# Altium schematic sheet USB.SchDoc
size B
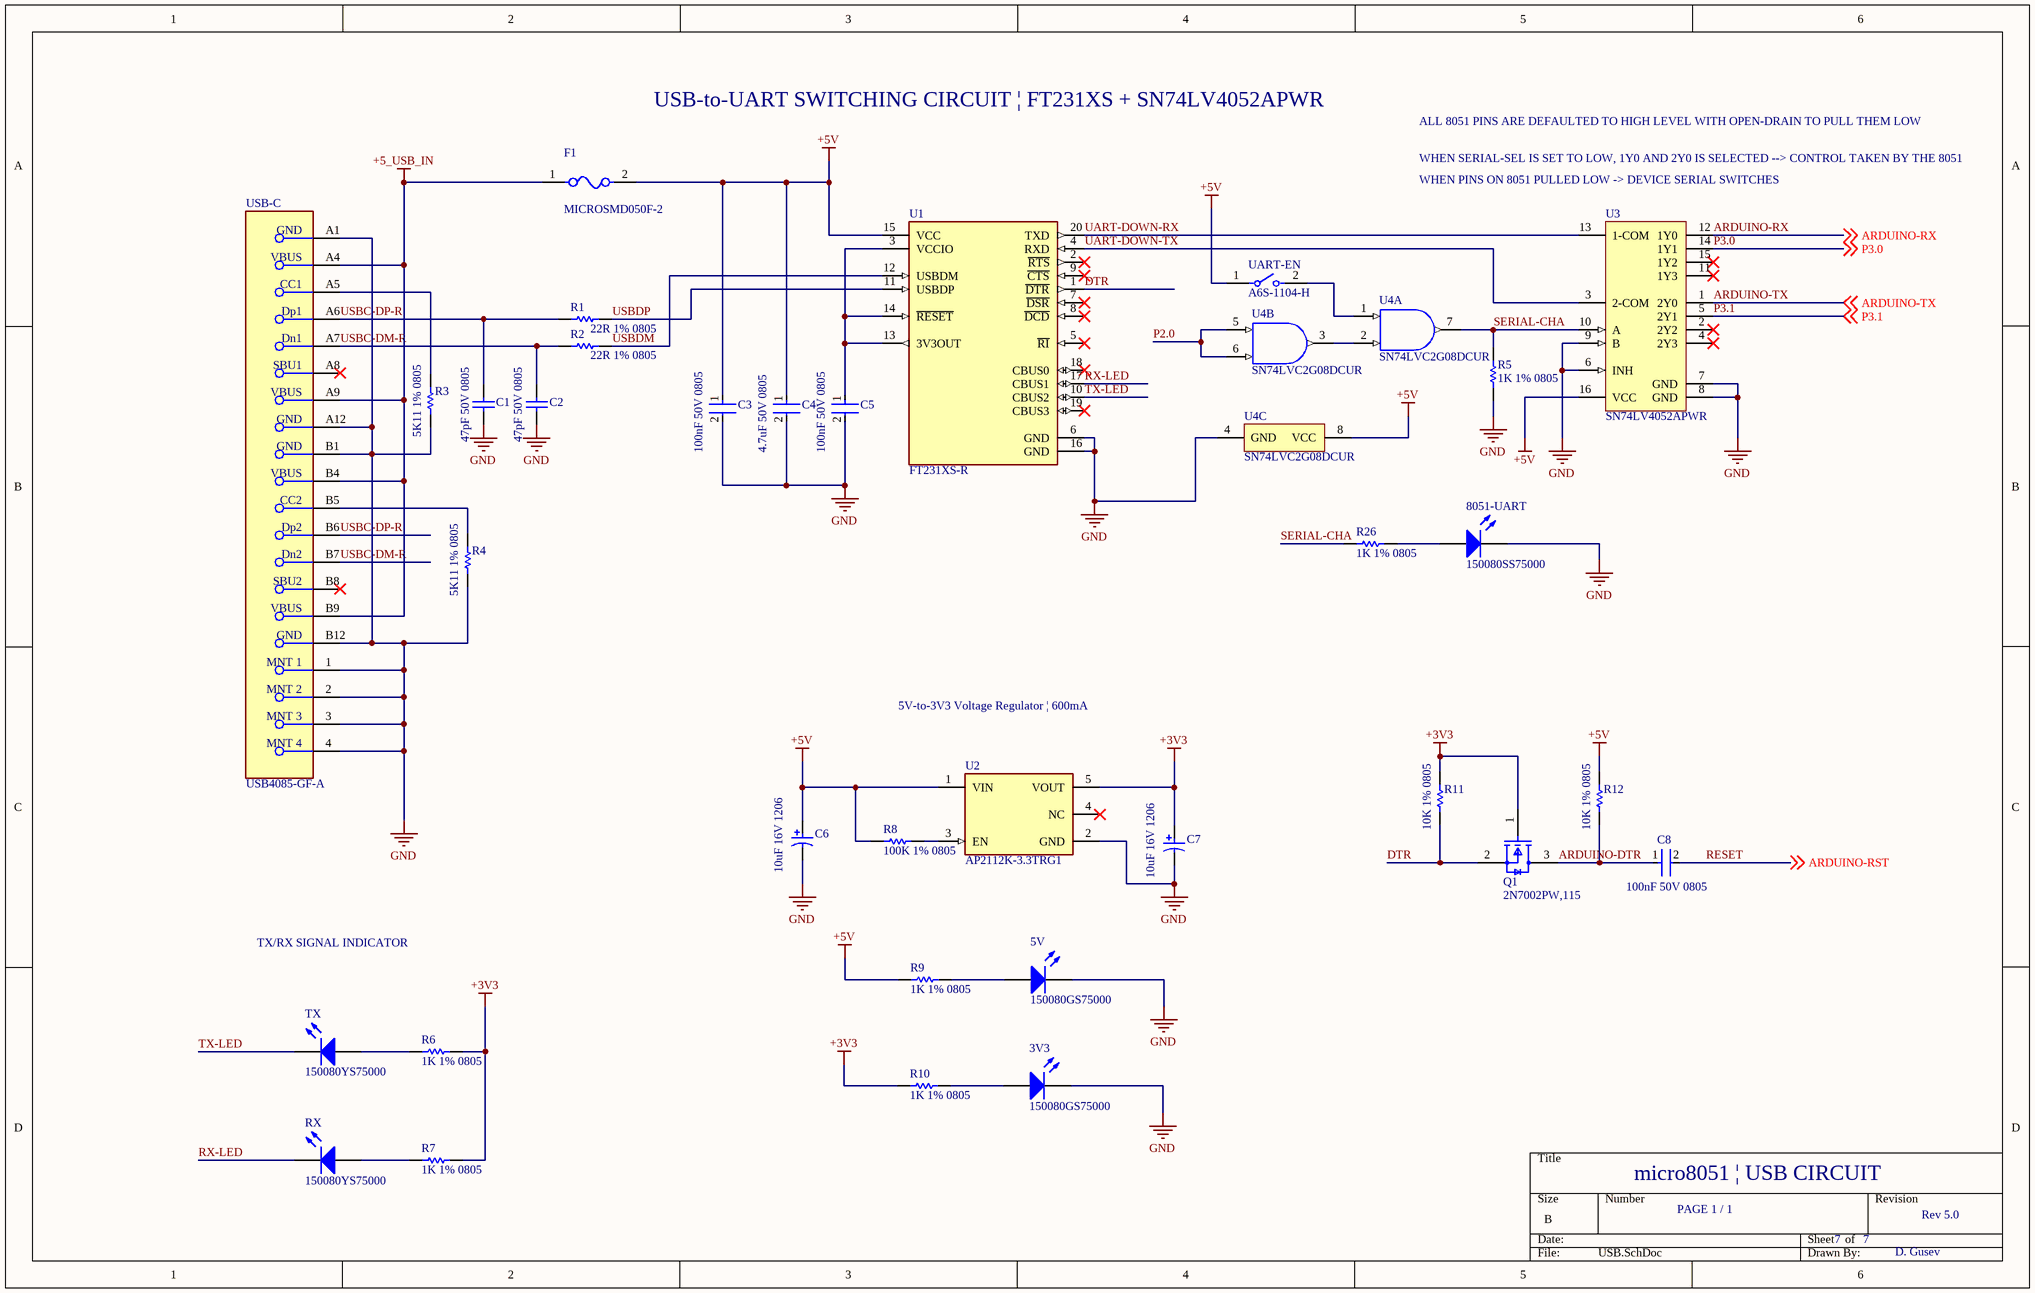
[diagram p0: USB.SchDoc]

## Parts
3V3  150080GS75000  [0805_A]
5V  150080GS75000  [0805_A]
8051-UART  150080SS75000  [0805_A]
C1  47pF 50V 0805  [CAPC2013X71X50NL20T25]
C2  47pF 50V 0805  [CAPC2013X71X50NL20T25]
C3  100nF 50V 0805  [FP-C0805C-DN-MFG]
C4  4.7uF 50V 0805  [FP-C2012-125-MFG]
C5  100nF 50V 0805  [FP-C0805C-DN-MFG]
C6  10uF 16V 1206  [KEMT-A-3216-18-2_M]
C7  10uF 16V 1206  [KEMT-A-3216-18-2_M]
C8  100nF 50V 0805  [FP-C0805C-DN-MFG]
F1  MICROSMD050F-2  [FP-microSMD-MFG]
Q1  2N7002PW,115  [FP-SOT323-MFG]
R1  22R 1% 0805  [RESC2013X70X40LL20T20]
R2  22R 1% 0805  [RESC2013X70X40LL20T20]
R3  5K11 1% 0805  [RESC0805(2012)_N]
R4  5K11 1% 0805  [RESC0805(2012)_N]
R5  1K 1% 0805  [RESC2013X60X40ML20T25]
R6  1K 1% 0805  [RESC2013X60X40ML20T25]
R7  1K 1% 0805  [RESC2013X60X40ML20T25]
R8  100K 1% 0805  [RESC2013X60X35ML10T20]
R9  1K 1% 0805  [RESC2013X60X40ML20T25]
R10  1K 1% 0805  [RESC2013X60X40ML20T25]
R11  10K 1% 0805  [RESC2013X60X35NL10T20]
R12  10K 1% 0805  [RESC2013X60X35NL10T20]
R26  1K 1% 0805  [RESC2013X60X40ML20T25]
RX  150080YS75000  [0805_A]
TX  150080YS75000  [0805_A]
U1  FT231XS-R  [FP-SSOP-20-MFG]
U2  AP2112K-3.3TRG1  [FP-SOT25-IPC_A]
U3  SN74LV4052APWR  [PW0016A_M]
U4  SN74LVC2G08DCUR  [DCU0008A_M]  (parts A,B,C of 3)
UART-EN  A6S-1104-H  [FP-A6S-1104-H-MFG]
USB-C  USB4085-GF-A  [FP-USB4085-GF-A-MFG]

## Nets
+3V3: C7.1 Q1.1(G) R6.1 R7.1 R10.2 R11.2 U2.5(VOUT)
+5_USB_IN: F1.1 USB-C.A4(VBUS) USB-C.A9(VBUS) USB-C.B4(VBUS) USB-C.B9(VBUS)
+5V: C3.1 C4.1 C6.1 F1.2 R8.2 R9.2 R12.2 U1.15(VCC) U2.1(VIN) U3.16(VCC) U4.8(VCC) UART-EN.1
GND: 3V3.1(K) 5V.1(K) 8051-UART.1(K) C1.1 C2.1 C3.2 C4.2 C5.2 C6.2 C7.2 R3.1 R4.1 R5.2 U1.6(GND) U1.16(GND) U2.2(GND) U3.6(INH) U3.7(GND) U3.8(GND) U3.9(B) U4.4(GND) USB-C.1(MNT_1) USB-C.2(MNT_2) USB-C.3(MNT_3) USB-C.4(MNT_4) USB-C.A1(GND) USB-C.A12(GND) USB-C.B1(GND) USB-C.B12(GND)
ARDUINO-DTR: C8.1 Q1.3(D) R12.1
ARDUINO-RX: U3.12(1Y0) ; off-sheet ARDUINO-RX
ARDUINO-TX: U3.1(2Y0) ; off-sheet ARDUINO-TX
DTR: Q1.2(S) R11.1 U1.1(~{DTR})
P2.0: U4.5(2A) U4.6(2B)
P3.0: U3.14(1Y1) ; off-sheet P3.0
P3.1: U3.5(2Y1) ; off-sheet P3.1
RESET: C8.2 ; off-sheet ARDUINO-RST  [also labelled ARDUINO-RST]
RX-LED: RX.1(K) U1.17(CBUS1)
SERIAL-CHA: R5.1 R26.1 U3.10(A) U4.7(1Y)
TX-LED: TX.1(K) U1.10(CBUS2)
UART-DOWN-RX: U1.20(TXD) U3.13(1-COM)
UART-DOWN-TX: U1.4(RXD) U3.3(2-COM)
USBC-DM-R: C2.2 R2.1 USB-C.A7(Dn1) USB-C.B7(Dn2)
USBC-DP-R: C1.2 R1.1 USB-C.A6(Dp1) USB-C.B6(Dp2)
USBDM: R2.2 U1.12(USBDM)
USBDP: R1.2 U1.11(USBDP)
Net3V3_2: 3V3.2(A) R10.1
Net5V_2: 5V.2(A) R9.1
Net8051-UART_2: 8051-UART.2(A) R26.2
NetC5_1: C5.1 U1.3(VCCIO) U1.13(3V3OUT) U1.14(~{RESET})
NetR3_2: R3.2 USB-C.A5(CC1)
NetR4_2: R4.2 USB-C.B5(CC2)
NetR6_2: R6.2 TX.2(A)
NetR7_2: R7.2 RX.2(A)
NetR8_1: R8.1 U2.3(EN)
NetU4_1: U4.1(1A) UART-EN.2
NetU4_2: U4.2(1B) U4.3(2Y)

Not connected (* = marked no-connect by the designer): U1 2(~{RTS})* 5(~{RI})* 7(~{DSR})* 8(~{DCD})* 9(~{CTS})* 18(CBUS0)* 19(CBUS3)*; U2 4(NC)*; U3 2(2Y2)* 4(2Y3)* 11(1Y3)* 15(1Y2)*; USB-C A8(SBU1)* B8(SBU2)*

## Notes on the sheet
- USB-to-UART SWITCHING CIRCUIT | FT231XS + SN74LV4052APWR
- WHEN SERIAL-SEL IS SET TO LOW, 1Y0 AND 2Y0 IS SELECTED --> CONTROL TAKEN BY THE 8051
- ALL 8051 PINS ARE DEFAULTED TO HIGH LEVEL WITH OPEN-DRAIN TO PULL THEM LOW
- (near U3) WHEN PINS ON 8051 PULLED LOW -> DEVICE SERIAL SWITCHES
- 5V-to-3V3 Voltage Regulator | 600mA
- TX/RX SIGNAL INDICATOR
- micro8051 | USB CIRCUIT
- PAGE 1 / 1
- 7
- Rev 5.0
- D. Gusev

## Library data of the parts
3V3 5V = CMP-1426-00007-1: SMD mono-color Chip LED, WL-SMCW, Green; Manufacturer: Wuerth Elektronik; PackageReference: 0805_A; Color: Green; PartNumber: 150080GS75000; ComponentLink2URL: http://katalog.we-online.com/led/datasheet/150080GS75000.pdf; ComponentLink1URL: http://www.we-online.com; ComponentLink1Description: Manufacturer URL; ComponentLink2Description: Datasheet
8051-UART = CMP-1426-00010-1: SMD mono-color Chip LED, WL-SMCW, Super Red; Manufacturer: Wuerth Elektronik; PackageReference: 0805_A; ComponentLink2URL: http://katalog.we-online.com/led/datasheet/150080SS75000.pdf; ComponentLink1URL: http://www.we-online.com; Color: Super Red; ComponentLink2Description: Datasheet; ComponentLink1Description: Manufacturer URL; PartNumber: 150080SS75000
C1 C2 = CMP-2007-04508-1: Part Number: 08055A470JAT2A; Manufacturer: AVX Interconnect / Elco
C3 C5 C8 = CMP-2007-00279-2: CAP CER 0.1UF 50V X7R 0805; Manufacturer Part Number: C0805C104K5RACTU; Manufacturer: KEMET; Value: 0.10 μF; Tolerance: 0.1; Temperature Coefficient: 30ppm/°C; Material: Ceramic; Device Class L2: Capacitors; Temperature Range Low: -55°C; Voltage Rating: 50 V; Digikey Description: CAP CER 0.1UF 50V X7R 0805; Category: Cap; ComponentLink2Description: Datasheet; Octopart: https://octopart.com/c0805c104k5ractu-kemet-143926; RoHS: TRUE; ComponentLink2URL: https://content.kemet.com/datasheets/KEM_C1003_C0G_SMD.pdf; Temperature Characteristic: X7R; Temperature: -55°C to +125°C; Height: 0.88mm; Temperature Range High: +125°C; Device Class L1: Passive Components; Automotive: No; Lead Free: Yes; Ipc Land Pattern Name: CAPC200125X78; Device Class L3: Ceramic Capacitors; Mouser Description: Cap Ceramic 0.1uF 50V X7R 10% SMD 2.0 x 1.2 mm 125 C Paper T/R; Capacitance: 0.10 μF; Package: C0805C-DN
C4 = CMP-08246-000007-1: CAP CER 4.7UF 50V X5R 0805; Manufacturer Part Number: C2012X5R1H475K125AB; Manufacturer: TDK Corporation; Tolerance: 10%; Temperature Coefficient: 15%; Material: Ceramic; Mouser Description: Multilayer Ceramic Capacitors MLCC - SMD/SMT 0805 4.7uF 50volts X5R 10%; Category: Cap; Temperature Range High: +85°C; Digikey Description: CAP CER 4.7UF 50V X5R 0805; Voltage Rating: 50V; Device Class L1: Passive Components; Temperature Range Low: -55°C; Lead Free: Yes; ComponentLink2Description: Datasheet; Capacitance: 4.7uF; Octopart: https://octopart.com/c2012x5r1h475k125ab-tdk-25947720; Device Class L2: Capacitors; Value: 4.7uF; Temperature: -55°C to +85°C; ComponentLink2URL: https://product.tdk.com/info/en/catalog/datasheets/mlcc_commercial_general_en.pdf; RoHS: TRUE; Height: 1.45mm; Temperature Characteristic: X5R; Package: C2012-125; Device Class L3: Ceramic Capacitors; Automotive: No
C6 C7 = CMP-2000-05173-1: Capacitor, Tantalum, 10 uF, +/- 10%, 16 V, -55 to 125 degC, 2-Pin SMD (1206), RoHS, Tape and Reel; Manufacturer: Kemet; Insulation: NotRequired; Voltage: 16VDC; Product Height (mm): 1.6mm; Polarity: Polar; Lead Spacing (nom): NotRequiredmm; Product Length (mm): 3.2mm; Case Style: Molded; DCL: 1.6uA; ESR: 7ohm; DF: 8%; Mounting Style: SurfaceMount; Manufacturer URL: http://www.kemet.com/; Datasheet Version: Apr-14; Package Description: 2-Pin Surface Mount Device, Body 3.2 x 1.6 mm; Operating Temp Range: -55Cto125C; Package Reference: 1206; Capacitance: 10uF; Wire Form: NotRequired; Datasheet URL: http://www.farnell.com/datasheets/1824869.pdf; Tolerance (+ or -): 10%; Failure Rate: NotRequired; Length W/Weld: NotRequiredmm; Package / Case: 3216-18; Seated Plane Height: NotRequiredmm; Product Diameter (mm): NotRequiredmm; Construction: SMTChip; Seal: NotRequired; Case Code: A; Product Depth (mm): 1.6mm; Packaging: TapeandReel
F1 = CMP-08606-000015-1: PTC RESET FUSE 13.2V 500MA 1210; Manufacturer: Littelfuse; Hold Current: 0.5A; Resistance: 0.25-0.9Ω; Trip Time: 0.05s; Value: 0.25-0.9Ω; Trip Current: 1A; Current Rating: 40A; Device Class L3: unset; ComponentLink2URL: https://www.littelfuse.com/~/media/electronics/datasheets/resettable_ptcs/littelfuse_ptc_microsmd_datasheet.pdf.pdf; Temperature: to +85°C; ComponentLink2Description: Datasheet; RoHS: TRUE; Category: Fuse; Ambient Temperature Range Low: -40°C; Lead Free: Yes; Device Class L1: Circuit Protection; Manufacturer Part Number: MICROSMD050F-2; Temperature Range High: +85°C; Ambient Temperature Range High: +85°C; Automotive: No; Height: 0.62mm; Digikey Description: PTC RESET FUSE 13.2V 500MA 1210; Voltage Rating: 13.2V; Package: microSMD; Octopart: https://octopart.com/microsmd050f-2-littelfuse-74214982; Device Class L2: PTC Resettable Fuses
Q1 = CMP-14409-000019-1: MOSFET N-CH 60V 0.31A SOT323
R1 R2 = CMP-2001-00523-1: Part Number: ERJ6ENF22R0V; Manufacturer: Panasonic
R3 R4 = CMP-1013-00591-1: 5K11 0.125W 1% 0805 (2012 Metric)  SMD; Case-Metric: 2012; Value: 5110.00 Ohm; Case-EIA: 0805; Technology: SMT; Tolerance: 1 %; Power: 0.125 W
R5-R7 R9 R10 R26 = CMP-2001-00590-1: Part Number: ERA6AEB123V; Manufacturer: Panasonic
R8 = CMP-2100-03668-1: Chip Resistor, 100 KOhm, +/- 1%, 0.125 W, -55 to 155 degC, 0805 (2012 Metric), RoHS, Tape and Reel; Manufacturer: Yageo; Max Power Dissipation: 125mW; Voltage Rating: 150V; Temperature Coefficient: 100ppm/degreesC; Manufacturer URL: http://www.yageo.com/; Min Operating Temperature: -55degC; Lead Pitch: 0.4mm; Composition: ThickFilm; Case Code (Metric): 2012; Military Standard: Not; Package Description: 2-Pin Surface Mounted Device, Body 2 x 1.25 mm; REACH SVHC: Unknown; RoHSCompliant: true; Depth: 1.25mm; Number of Pins: 2; Lead Free: LeadFree; Resistance: 100KOhm; Datasheet URL: http://www.yageo.com/NewPortal/yageodocoutput?fileName=/pdf/R-Chip/PYu-RC_Group_51_RoHS_L_5.pdf; Max Operating Temperature: 155degC; Case/Package: 0805; Package Quantity: 1; Case Code (Imperial): 0805; Power Rating: 125mW; Width: 0.049inch; Package Reference: 0805; Height: 0.024inch; Termination: SMD/SMT; Tolerance: 1%; Datasheet Version: Rev. 5, 10/2016; Length: 2mm; Voltage Rating (DC): 150V; Number of Terminations: 2; Packaging: TapeandReel
R11 R12 = CMP-1659-00013-4: Chip Resistor, 10 KOhm, +/- 1%, 0.125 W, -55 to 155 degC, 0805 (2012 Metric), RoHS, Tape and Reel; Manufacturer: Yageo; Voltage Rating: 150 V; Mount: Surface Mount; ComponentLink1Description: Manufacturer URL; ComponentLink2URL: http://www.yageo.com/documents/recent/PYu-RC_Group_51_RoHS_L_04.pdf; Pins: 2; Length: 2 mm; Min Operating Temperature: -55 degC; Height: 0.5 mm; Mounting Technology: Surface Mount; RoHSCompliant: true; REACH SVHC: No SVHC; ComponentLink1URL: http://www.yageo.com/; Max Operating Temperature: 155 degC; PackageReference: 0805; DatasheetVersion: Rev. 4, 02/2016; Package Quantity: 5000; Packaging: Tape and Reel; ComponentLink2Description: Datasheet; PackageDescription: 2-Pin Surface Mounted Device, Body 2 x 1.25 mm
RX TX = CMP-1426-00012-1: SMD mono-color Chip LED, WL-SMCW, Yellow; Manufacturer: Wuerth Elektronik; Color: Yellow; ComponentLink1URL: http://www.we-online.com; PackageReference: 0805_A; ComponentLink2URL: http://katalog.we-online.com/led/datasheet/150080YS75000.pdf; ComponentLink1Description: Manufacturer URL; ComponentLink2Description: Datasheet; PartNumber: 150080YS75000
U1 = CMP-0248-00024-3: IC USB SERIAL FULL UART 20SSOP; Operating Supply Voltage: 5V; Operating Supply Current: 8mA; Number of Channels: 1; Min Supply Voltage: 2.97V; Max Supply Voltage: 5.5V; Data Rate: 12Mbps; Height: 0.059inch; Packaging: Tape and Reel; Mount: Surface Mount; Package Quantity: 2000; Radiation Hardening: No; Case/Package: SSOP; Min Operating Temperature: -40°C; Width: 0.157inch; Number of Pins: 20; Weight: 0.016oz; Interface: UART; Max Operating Temperature: 85°C; Length: 8.74mm
U2 = CMP-12756-000035-1: IC REG LINEAR 3.3V 600MA SOT25; Number of Regulators: 1; Output Type: Fixed; Polarity: Positive; Min Input Voltage: 2.5V; Max Input Voltage: 6V; Accuracy: 1.5%; Quiescent Current: 55uA; Dropout Voltage: 250mV; Min Operating Temperature: -40°C; Length: 3.1mm; Output Current: 600mA; Max Operating Temperature: 85°C; Package Quantity: 1; Output Voltage: 3.3V; Width: 1.7mm; Number of Outputs: 1; Packaging: Tape and Reel; Height: 1.3mm; Lead Free: Lead Free; Max Output Current: 600mA; Case/Package: SOT-23-5; Mount: Surface Mount; Number of Pins: 5
U3 = CMP-0802-00041-4: Dual 4-Channel Analog Multiplexer/Demultiplexer, PW0016A, LARGE T&R; Manufacturer: Texas Instruments; VCC(Min)(V): 2; Crosstalk: Yes; Rating: Catalog; Ron(Max)(Ohms): 75; Ron(Typ)(Ohms): 25; Configuration: 2 X 1：4 MUX; VCC(Max)(V): 5.5; Bandwidth(Max)(MHz): 50; Output Type: CMOS; PackageReference: PW0016A; Operating Temperature Range(C): -40 to 85; DatasheetVersion: SCLS429J; PackageVersion: http://www.ti.com/lit/ml/mpds361/mpds361.pdf; Generic Part Number: SN74LV4052A; Code_JEDEC: MO-153
U4 = CMP-0859-00670-3: Dual 2-Input Positive-AND Gate, DCU0008A, LARGE T&R; Manufacturer: Texas Instruments; Logic: True; Output Drive (IOL/IOH)(Max)(mA): 32/-32; F @ Nom Voltage(Max)(Mhz): 150; Technology Family: LVC; Rating: Catalog; tpd @ Nom Voltage(Max)(ns): 9.8,5.8,5.3,4.8; Voltage(Nom)(V): 1.8,2.5,3.3,5; Schmitt Trigger: No; Input Type: CMOS/TTL; Bits(#): 2; Gate Type: AND; VCC(Max)(V): 5.5; VCC(Min)(V): 1.65; ICC @ Nom Voltage(Max)(mA): 0.01; Output Type: CMOS; Sub-Family: AND Gate; PackageReference: DCU0008A; Operating Temperature Range(C): -40 to 125,-40 to 85; 3-State Output: No; DatasheetVersion: SCES198M; Generic Part Number: SN74LVC2G08
UART-EN = CMP-08827-000005-1: SWITCH SLIDE DIP SPST 25MA 24V; Manufacturer: Omron Electronics Inc-EMC Div; Throw Configuration: SPST-NO; Standoff Height: 0mm; Number Of Circuits: 1; Electromechanical Life: 1000Cycles; Contact Resistance: 200mΩ; Digikey Description: SWITCH SLIDE DIP SPST 25MA 24V; ComponentLink2Description: Datasheet; Mount: Surface Mount; Manufacturer Part Number: A6S-1104-H; ComponentLink2URL: https://omronfs.omron.com/en_US/ecb/products/pdf/en-a6s.pdf; Category: Switch; Height: 3.95mm; Device Class L3: DIP Switches; Octopart: https://octopart.com/a6s-1104-h-omron-55410938; Mouser Description: DIP Switches / SIP Switches Dip Switch; Lead Free: Yes; Temperature Range Low: -20°C; Temperature Range High: +70°C; Automotive: No; Ambient Temperature Range Low: -20°C; Ambient Temperature Range High: +70°C; Voltage Rating Dc: 24V; Device Class L2: Switches; RoHS: TRUE; Package: 0; Contact Current Rating: 25mA; Device Class L1: Electromechanical; Temperature: -20°C to +70°C
USB-C = CMP-196119-000001-1: CONN RCPT USB2.0 TYPEC 16POS; Manufacturer: Global Connector Technology; Voltage Rating: 20V; Conn Orientation: Right Angle; Shielding: true; Current Rating: 4.25A; Number Of Contacts: 16; Pitch: 0.85mm; Is Female: yes; ComponentLink2URL: https://gct.co/files/drawings/usb4085.pdf; Category: Conn; Automotive: No; ComponentLink2Description: Datasheet; Height: 3.66mm; Manufacturer Part Number: USB4085-GF-A; Package: 0; Usb Standard: USB 2.0; Octopart: https://octopart.com/usb4085-gf-a-global+connector+technology-94773699; Device Class L3: unset; Digikey Description: CONN RCPT USB2.0 TYPEC 16POS; Temperature Range Low: -40°C; Temperature: -40°C to +85°C; Lead Free: Yes; Contact Material: Gold,Nickel; Device Class L1: Connectors; Temperature Range High: +85°C; Device Class L2: USB Connectors; RoHS: TRUE